# Altium project 邮票孔.PrjPcb
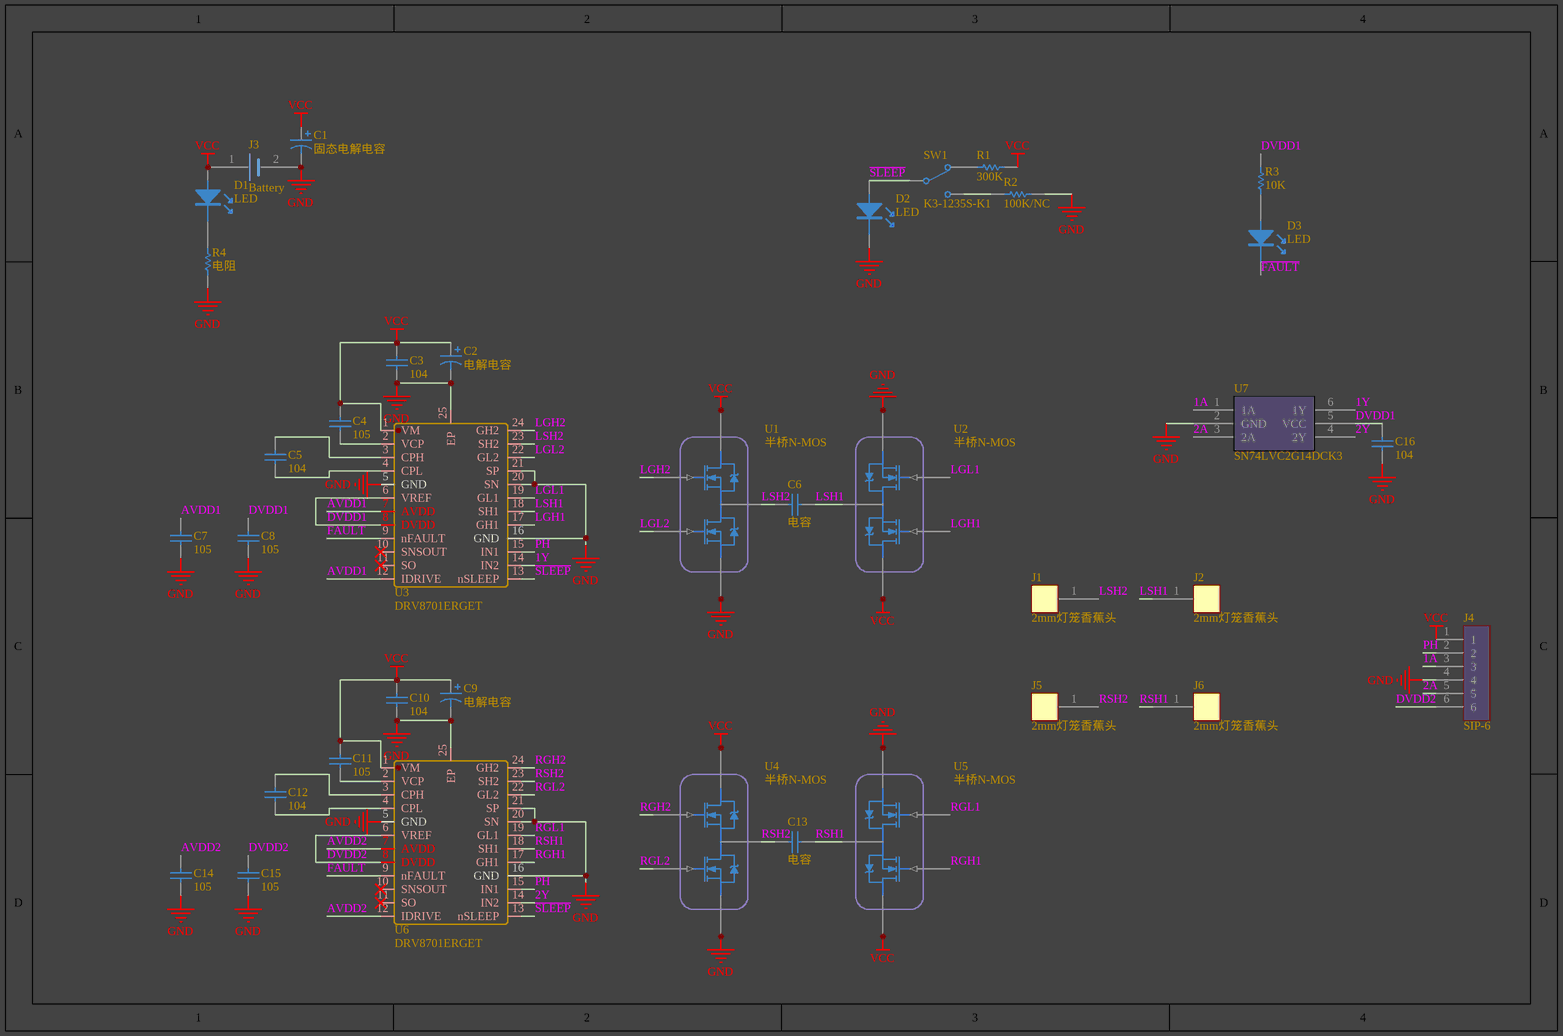
[diagram p0: 原理图.SchDoc]
嘉立创: TRUE; 雕刻机: FALSE
1 sheet, 37 parts. Net scope: global (net labels, ports and power ports of the same name join across sheets).
Board file: 4层.PcbDoc

## Sheet 原理图.SchDoc
size A4

### Parts
C1  固态电解电容  [贴片电解 10*10.5]
C2  电解电容  [贴片电解 4*5.4]
C3  104  [C0402]
C4  105  [C0402]
C5  104  [C0402]
C6  电容  [C0603]
C7  105  [C0402]
C8  105  [C0402]
C9  电解电容  [贴片电解 4*5.4]
C10  104  [C0402]
C11  105  [C0402]
C12  104  [C0402]
C13  电容  [C0603]
C14  105  [C0402]
C15  105  [C0402]
C16  104  [C0402]
D1  LED  [LED 0603B]
D2  LED  [LED 0603G]
D3  LED  [LED 0603R]
J1  2mm灯笼香蕉头  [MOTOR]
J2  2mm灯笼香蕉头  [MOTOR]
J3  Battery  [T插]
J4  SIP-6  [PH2.0-6P]
J5  2mm灯笼香蕉头  [MOTOR]
J6  2mm灯笼香蕉头  [MOTOR]
R1  300K  [R0402]
R2  100K/NC  [R0402]
R3  10K  [R0402]
R4  电阻  [R0402]
SW1  K3-1235S-K1  [K3-1235S-K1]
U1  半桥N-MOS  [VDFN8]
U2  半桥N-MOS  [VDFN8]
U3  DRV8701ERGET  [VQFN-24_24PIN-L4.00-W4.00-PITCH0.50-EP-TL]
U4  半桥N-MOS  [VDFN8]
U5  半桥N-MOS  [VDFN8]
U6  DRV8701ERGET  [VQFN-24_24PIN-L4.00-W4.00-PITCH0.50-EP-TL]
U7  SN74LVC2G14DCK3  [SC70]

### Nets
GND: C1.2 C2.2 C3.1 C7.1 C8.1 C9.2 C10.1 C14.1 C15.1 C16.1 D2.K J3.2(-) J4.4 R2.1 R4.1 U1.5(SL) U1.6(SL) U1.7(S) U2.5(SL) U2.6(SL) U2.7(S) U3.5(GND) U3.16(GND) U3.20(SN) U3.21(SP) U3.25(EP) U4.5(SL) U4.6(SL) U4.7(S) U5.5(SL) U5.6(SL) U5.7(S) U6.5(GND) U6.16(GND) U6.20(SN) U6.21(SP) U6.25(EP) U7.2(GND)
VCC: C1.1 C2.1 C3.2 C4.2 C9.1 C10.2 C11.2 D1.A J3.1(+) J4.1 R1.1 U1.2(D) U1.3(D) U1.4(D) U1.10(D) U2.2(D) U2.3(D) U2.4(D) U2.10(D) U3.1(VM) U4.2(D) U4.3(D) U4.4(D) U4.10(D) U5.2(D) U5.3(D) U5.4(D) U5.10(D) U6.1(VM)
1A: J4.3 U7.1(1A)
1Y: U3.14(IN2) U7.6(1Y)
2A: J4.5 U7.3(2A)
2Y: U6.14(IN2) U7.4(2Y)
~{FAULT}: D3.K U3.9(nFAULT) U6.9(nFAULT)
~{SLEEP}: D2.A SW1.2 U3.13(nSLEEP) U6.13(nSLEEP)
AVDD1: C7.2 U3.7(AVDD) U3.12(IDRIVE)
AVDD2: C14.2 U6.7(AVDD) U6.12(IDRIVE)
DVDD1: C8.2 C16.2 R3.1 U3.6(VREF) U3.8(DVDD) U7.5(VCC)
DVDD2: C15.2 J4.6 U6.6(VREF) U6.8(DVDD)
LGH1: U2.1(GH) U3.17(GH1)
LGH2: U1.1(GH) U3.24(GH2)
LGL1: U2.8(GL) U3.19(GL1)
LGL2: U1.8(GL) U3.22(GL2)
LSH1: C6.2 J2.1 U2.9 U3.18(SH1)
LSH2: C6.1 J1.1 U1.9 U3.23(SH2)
PH: J4.2 U3.15(IN1) U6.15(IN1)
RGH1: U5.1(GH) U6.17(GH1)
RGH2: U4.1(GH) U6.24(GH2)
RGL1: U5.8(GL) U6.19(GL1)
RGL2: U4.8(GL) U6.22(GL2)
RSH1: C13.2 J6.1 U5.9 U6.18(SH1)
RSH2: C13.1 J5.1 U4.9 U6.23(SH2)
NetC4_1: C4.1 U3.2(VCP)
NetC5_1: C5.1 U3.4(CPL)
NetC5_2: C5.2 U3.3(CPH)
NetC11_1: C11.1 U6.2(VCP)
NetC12_1: C12.1 U6.4(CPL)
NetC12_2: C12.2 U6.3(CPH)
NetD1_K: D1.K R4.2
NetD3_A: D3.A R3.2
NetR1_2: R1.2 SW1.1
NetR2_2: R2.2 SW1.3

Not connected (* = marked no-connect by the designer): U3 10(SNSOUT)* 11(SO)*; U6 10(SNSOUT)* 11(SO)*

### Notes on the sheet
- Title
- Size:
- Date:
- A4
- Number:
- Time:
- Revision:
- Sheet
- of
- File:

### Library data of the parts
C1 C2 C9 = 电解电容: Polarized Capacitor (Axial); Value: 100pF; Published: 8-Jun-2000; LatestRevisionDate: 17-Jul-2002; LatestRevisionNote: Re-released for DXP Platform.; PackageReference: POLAR0.8; Publisher: Altium Limited; PackageDescription: Polarized Capacitor; 2 Leads
C3-C8 C10-C16 = 电容: Capacitor; Value: 22pF; Published: 8-Jun-2000; LatestRevisionDate: 17-Jul-2002; LatestRevisionNote: Re-released for DXP Platform.; PackageReference: RAD-0.3; Publisher: Altium Limited; PackageDescription: Radial Cap, Thru-Hole; 2 Leads; 0.3 in Pin Spacing
R1-R4 = 电阻: Resistor; Value: 150R; Published: 8-Jun-2000; LatestRevisionDate: 17-Jul-2002; LatestRevisionNote: Re-released for DXP Platform.; PackageReference: AXIAL-0.3; Publisher: Altium Limited; PackageDescription: Axial Device, Thru-Hole; 2 Leads; 0.3 in Pin Spacing
SW1 = 单刀双掷: Switch
U3 U6 = DRV8701: H桥驱动; BOM_Manufacturer: TI; Contributor: LCSC; BOM_Supplier: LCSC; BOM_Manufacturer Part: DRV8701ERGET; BOM_Supplier Part: C132049; spicePre: U
U7 = SN74LVC2G14DCK3: 门级和反向器; SourceLibrary: TI_2020-07-01; Built_By: EMA_Matt; Vendor: Texas Instruments; Manufacturer_Part_Number: SN74LVC2G14DCK3; Datasheet: https://www.ti.com/lit/ds/symlink/sn74lvc2g14.pdf?HQS=TI-null-null-mousermode-df-pf-null-wwe&ts=1593468560008&ref_url=https%253A%252F%252Fwww.mouser.com%252F; Copyright: Copyright (C) 2018 Accelerated Designs. All rights reserved; RefDes: RefDes; Type: DEV